# Altium schematic sheet Expansion connectors.SchDoc: Motor Vibration
size A4; Organization: NTUST EE-305; Address1: No.43, Sec. 4, Keelung Rd.; Address2: Da’an Dist.; Address3: Taipei 106; Address4: Taiwan (R.O.C.); DocumentNumber: 1; Revision: 3.0; SheetNumber: 8; SheetTotal: 9
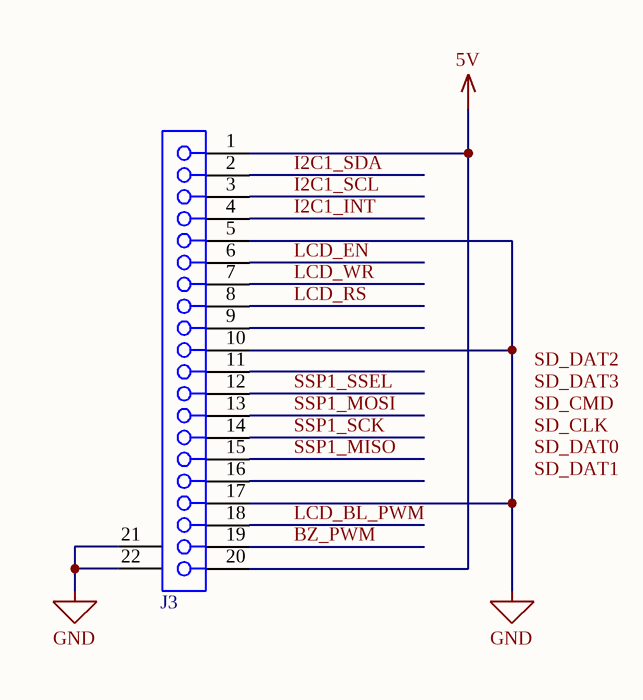
[diagram p0: Expansion connectors.SchDoc]

## Parts
J3  FFC 20P 0.5mm  [FPC_20P_0.5mm]  (value not drawn)

## Nets
5V: J3.1 J3.20
GND: J3.5 J3.10 J3.17 J3.21(MH1) J3.22(MH2)
BZ_PWM: J3.19
I2C1_INT: J3.4
I2C1_SCL: J3.3
I2C1_SDA: J3.2
LCD_BL_PWM: J3.18
LCD_EN: J3.6
LCD_RS: J3.8
LCD_WR: J3.7
SSP1_MISO: J3.15
SSP1_MOSI: J3.13
SSP1_SCK: J3.14
SSP1_SSEL: J3.12

Not connected (* = marked no-connect by the designer): J3 9 11 16

## Notes on the sheet
- Labels drawn without touching a wire or pin: SD_CLK, SD_CMD, SD_DAT0, SD_DAT1, SD_DAT2, SD_DAT3
- Title
- Name
- Size:
- Revision:
- A4
- Date:
- Time:
- Sheet
- of

## Library data of the parts
J3 = Molex,-LLC 5051102091: CONN FFC/FPC BOTTOM 20P .5MM R/A; Supplier 1: Digi-Key; Supplier Part Number 1: WM11287CT-ND